# EAGLE design M220new (EAGLE 6.6.0)
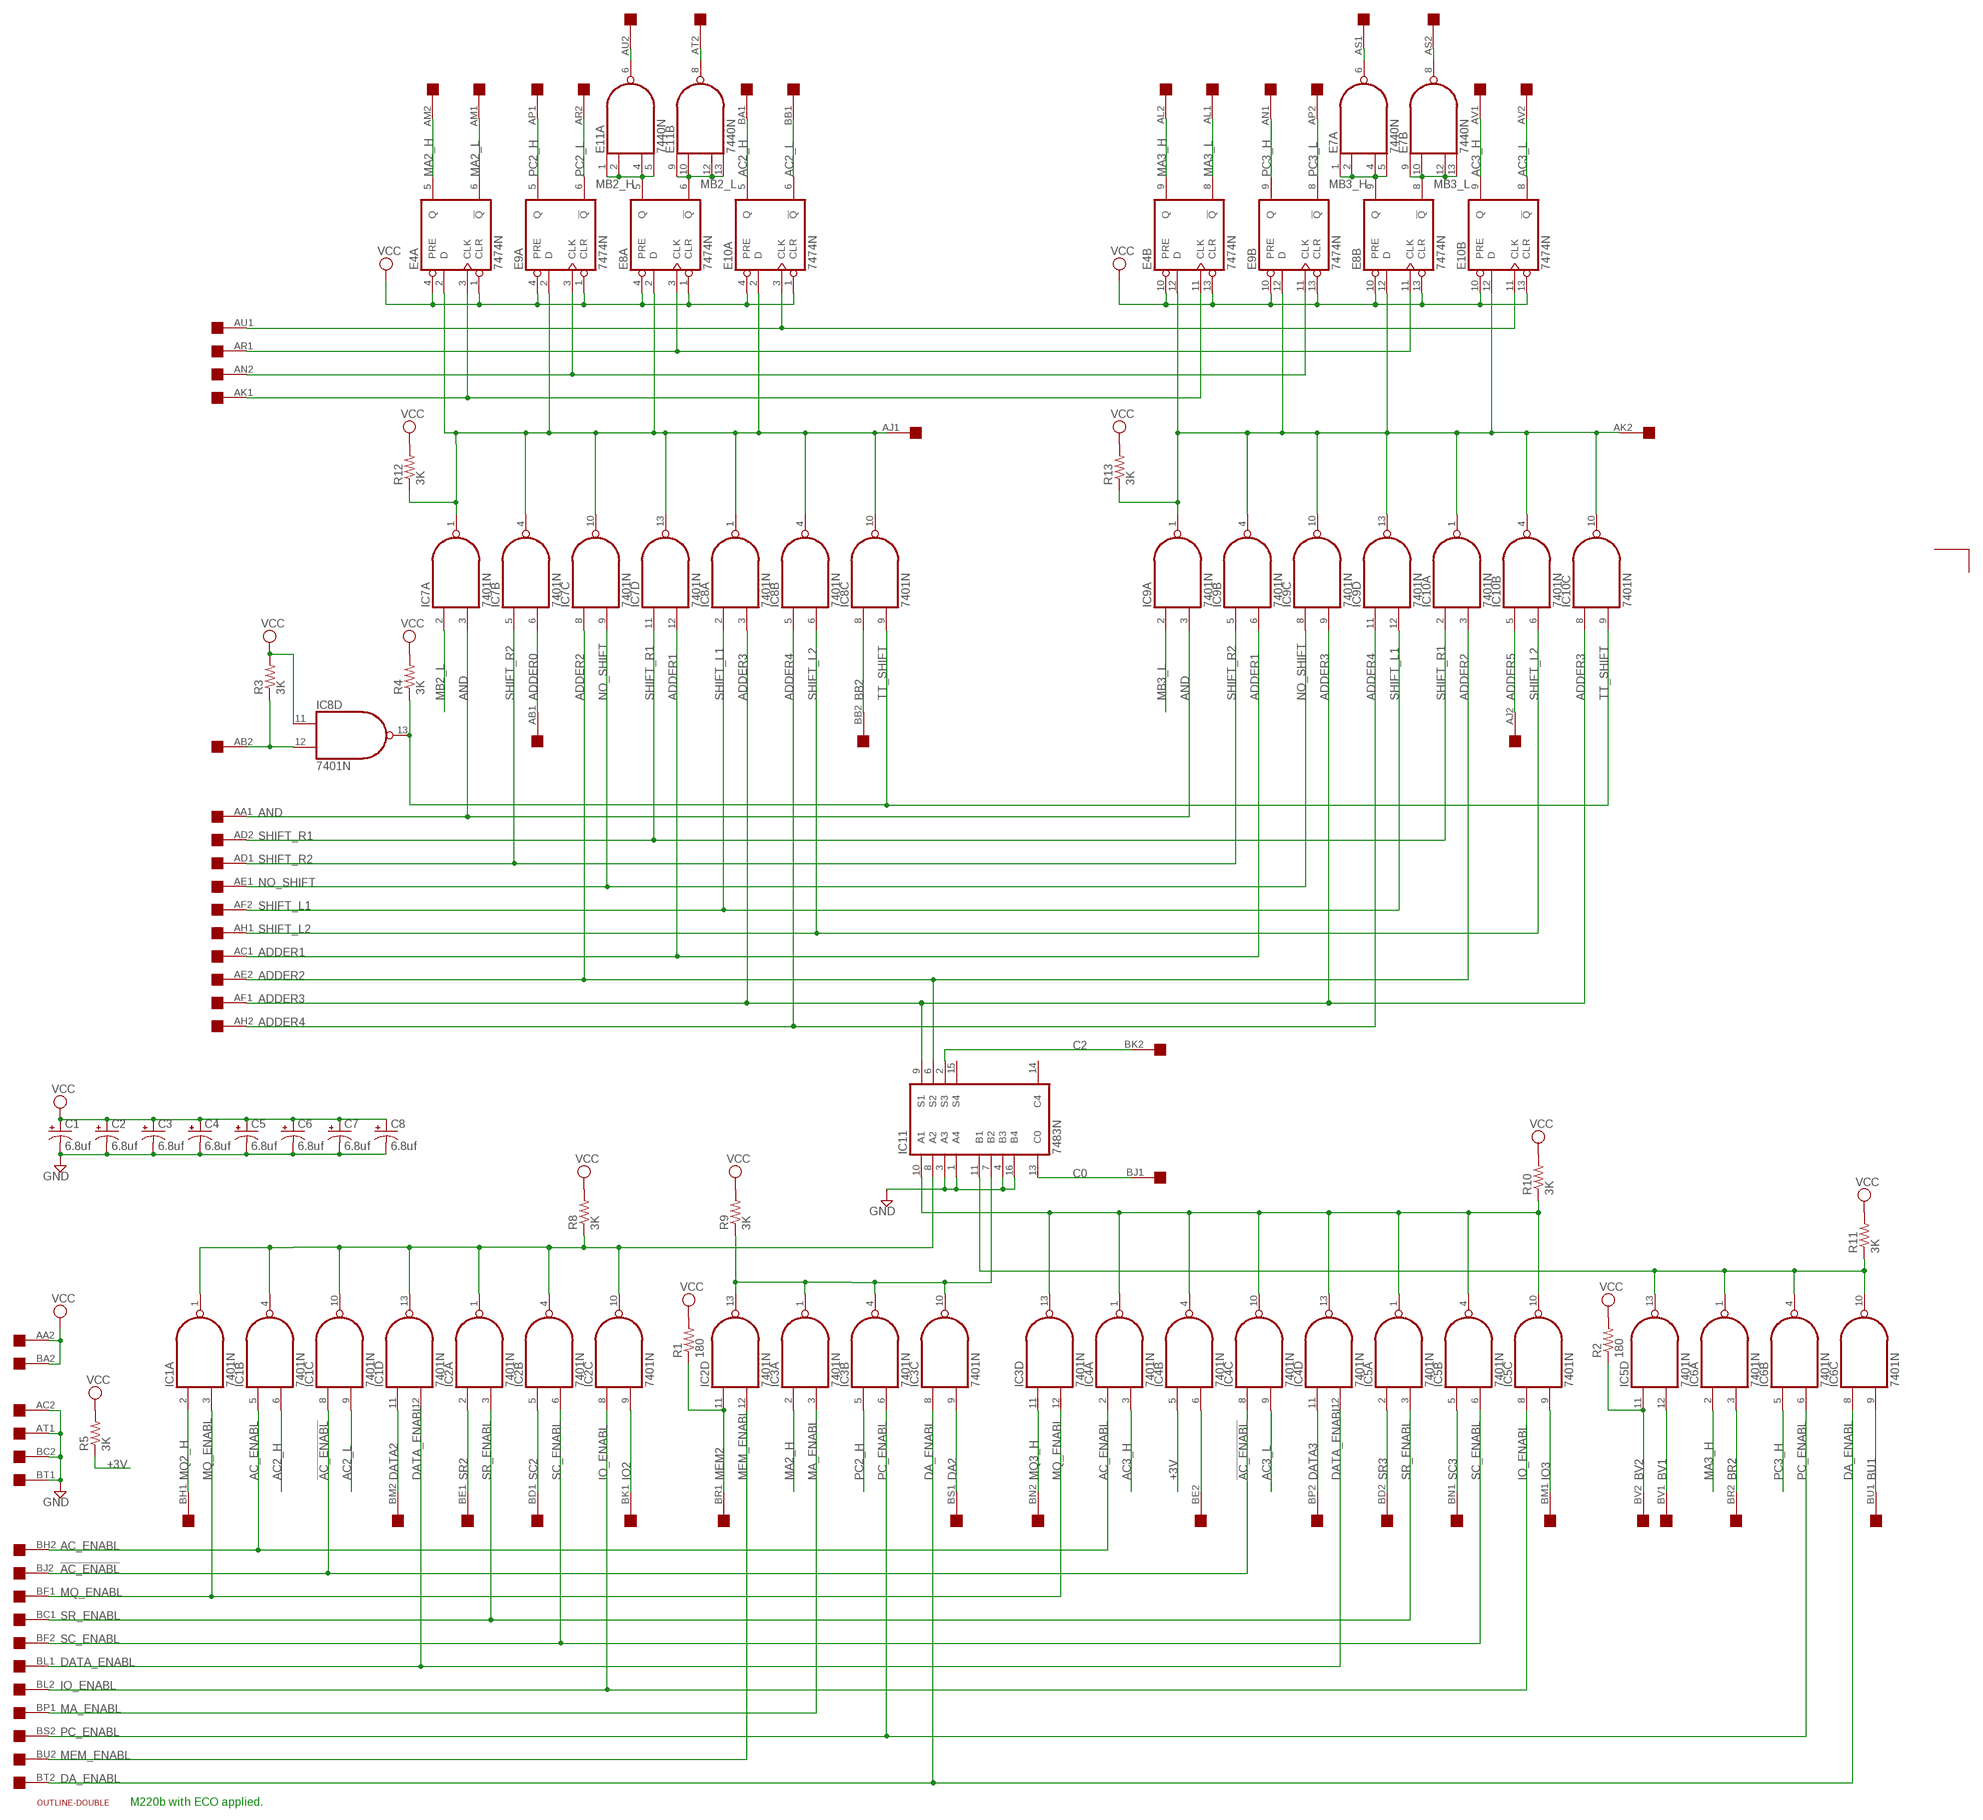
[diagram p0: schematic, sheet 1]

## Parts
C1  6.8uf  CPOL-USE15-5AXIAL  [E15-5]
C2  6.8uf  CPOL-USE15-5AXIAL  [E15-5]
C3  6.8uf  CPOL-USE15-5AXIAL  [E15-5]
C4  6.8uf  CPOL-USE15-5AXIAL  [E15-5]
C5  6.8uf  CPOL-USE15-5AXIAL  [E15-5]
C6  6.8uf  CPOL-USE15-5AXIAL  [E15-5]
C7  6.8uf  CPOL-USE15-5AXIAL  [E15-5]
C8  6.8uf  CPOL-USE15-5AXIAL  [E15-5]
E4  7474N  74S74N  [DIL14]
E7  7440N  74S20N  [DIL14]
E8  7474N  74S74N  [DIL14]
E9  7474N  74S74N  [DIL14]
E10  7474N  74S74N  [DIL14]
E11  7440N  74S20N  [DIL14]
IC1  7401N  74LS01N  [DIL14]
IC2  7401N  74LS01N  [DIL14]
IC3  7401N  74LS01N  [DIL14]
IC4  7401N  74LS01N  [DIL14]
IC5  7401N  74LS01N  [DIL14]
IC6  7401N  74LS01N  [DIL14]
IC7  7401N  74LS01N  [DIL14]
IC8  7401N  74LS01N  [DIL14]
IC9  7401N  74LS01N  [DIL14]
IC10  7401N  74LS01N  [DIL14]
IC11  7483N  [DIL16]
R1  180  R-US_0207/10  [0207/10]
R2  180  R-US_0207/10  [0207/10]
R3  3K  R-US_0207/10  [0207/10]
R4  3K  R-US_0207/10  [0207/10]
R5  3K  R-US_0207/10  [0207/10]
R8  3K  R-US_0207/10  [0207/10]
R9  3K  R-US_0207/10  [0207/10]
R10  3K  R-US_0207/10  [0207/10]
R11  3K  R-US_0207/10  [0207/10]
R12  3K  R-US_0207/10  [0207/10]
R13  3K  R-US_0207/10  [0207/10]
U$1  DOUBLE  [EDGE-CON4]
U$2  OUTLINE-DOUBLE  [DOUBLE]

## Nets
!AC_ENABL: IC1.8(C:I0) IC4.8(C:I0) U$1.BJ2
!TT_SHIFT: IC8.12(D:I1) R3.1 U$1.AB2
+3V: IC4.5(B:I0) R5.1
AC2_H: E10.5(A:Q) IC1.6(B:I1) U$1.BA1
AC2_L: E10.6(A:!Q) IC1.9(C:I1) U$1.BB1
AC3_H: E10.9(B:Q) IC4.3(A:I1) U$1.AV1
AC3_L: E10.8(B:!Q) IC4.9(C:I1) U$1.AV2
AC_ENABL: IC1.5(B:I0) IC4.2(A:I0) U$1.BH2
ADDER0: IC7.6(B:I1) U$1.AB1
ADDER1: IC7.12(D:I1) IC9.6(B:I1) U$1.AC1
ADDER2: IC7.8(C:I0) IC10.3(A:I1) IC11.6(S2) U$1.AE2
ADDER3: IC8.3(A:I1) IC9.9(C:I1) IC10.8(C:I0) IC11.9(S1) U$1.AF1
ADDER4: IC8.5(B:I0) IC9.11(D:I0) U$1.AH2
ADDER5: IC10.5(B:I0) U$1.AJ2
AJ1: E4.2(A:D) E8.2(A:D) E9.2(A:D) E10.2(A:D) IC7.1(A:O) IC7.4(B:O) IC7.10(C:O) IC7.13(D:O) IC8.1(A:O) IC8.4(B:O) IC8.10(C:O) R12.1 U$1.AJ1
AK1: E4.3(A:CLK) E4.11(B:CLK) U$1.AK1
AK2: E4.12(B:D) E8.12(B:D) E9.12(B:D) E10.12(B:D) IC9.1(A:O) IC9.4(B:O) IC9.10(C:O) IC9.13(D:O) IC10.1(A:O) IC10.4(B:O) IC10.10(C:O) R13.1 U$1.AK2
AN2: E9.3(A:CLK) E9.11(B:CLK) U$1.AN2
AND: IC7.3(A:I1) IC9.3(A:I1) U$1.AA1
AR1: E8.3(A:CLK) E8.11(B:CLK) U$1.AR1
AS1: E7.6(A:O) U$1.AS1
AS2: E7.8(B:O) U$1.AS2
AT2: E11.8(B:O) U$1.AT2
AU1: E10.3(A:CLK) E10.11(B:CLK) U$1.AU1
AU2: E11.6(A:O) U$1.AU2
BB2: IC8.8(C:I0) U$1.BB2
BE2: IC4.6(B:I1) U$1.BE2
BR2: IC6.3(A:I1) U$1.BR2
BU1: IC6.9(C:I1) U$1.BU1
BV1: IC5.12(D:I1) U$1.BV1
BV2: IC5.11(D:I0) R2.1 U$1.BV2
C0: IC11.13(C0) U$1.BJ1
C2: IC11.2(S3) U$1.BK2
DA2: IC3.9(C:I1) U$1.BS1
DA_ENABL: IC3.8(C:I0) IC6.8(C:I0) U$1.BT2
DATA2: IC1.11(D:I0) U$1.BM2
DATA3: IC4.11(D:I0) U$1.BP2
DATA_ENABL: IC1.12(D:I1) IC4.12(D:I1) U$1.BL1
GND: C1.- C2.- C3.- C4.- C5.- C6.- C7.- C8.- IC11.1(A4) IC11.3(A3) IC11.4(B3) IC11.16(B4) U$1.AC2 U$1.AT1 U$1.BC2 U$1.BT1
IO2: IC2.9(C:I1) U$1.BK1
IO3: IC5.9(C:I1) U$1.BM1
IO_ENABL: IC2.8(C:I0) IC5.8(C:I0) U$1.BL2
MA2_H: E4.5(A:Q) IC3.2(A:I0) U$1.AM2
MA2_L: E4.6(A:!Q) U$1.AM1
MA3_H: E4.9(B:Q) IC6.2(A:I0) U$1.AL2
MA3_L: E4.8(B:!Q) U$1.AL1
MA_ENABL: IC3.3(A:I1) U$1.BP1
MB2_H: E8.5(A:Q) E11.1(A:I0) E11.2(A:I1) E11.4(A:I2) E11.5(A:I3)
MB2_L: E8.6(A:!Q) E11.9(B:I0) E11.10(B:I1) E11.12(B:I2) E11.13(B:I3) IC7.2(A:I0)
MB3_H: E7.1(A:I0) E7.2(A:I1) E7.4(A:I2) E7.5(A:I3) E8.9(B:Q)
MB3_L: E7.9(B:I0) E7.10(B:I1) E7.12(B:I2) E7.13(B:I3) E8.8(B:!Q) IC9.2(A:I0)
MEM2: IC2.11(D:I0) R1.1 U$1.BR1
MEM_ENABL: IC2.12(D:I1) U$1.BU2
MQ2_H: IC1.2(A:I0) U$1.BH1
MQ3_H: IC3.11(D:I0) U$1.BN2
MQ_ENABL: IC1.3(A:I1) IC3.12(D:I1) U$1.BF1
N$5: IC1.1(A:O) IC1.4(B:O) IC1.10(C:O) IC1.13(D:O) IC2.1(A:O) IC2.4(B:O) IC2.10(C:O) IC11.8(A2) R8.1
N$8: IC3.13(D:O) IC4.1(A:O) IC4.4(B:O) IC4.10(C:O) IC4.13(D:O) IC5.1(A:O) IC5.4(B:O) IC5.10(C:O) IC11.10(A1) R10.1
N$12: IC2.13(D:O) IC3.1(A:O) IC3.4(B:O) IC3.10(C:O) IC11.7(B2) R9.1
N$14: IC5.13(D:O) IC6.1(A:O) IC6.4(B:O) IC6.10(C:O) IC11.11(B1) R11.1
NO_SHIFT: IC7.9(C:I1) IC9.8(C:I0) U$1.AE1
PC2_H: E9.5(A:Q) IC3.5(B:I0) U$1.AP1
PC2_L: E9.6(A:!Q) U$1.AR2
PC3_H: E9.9(B:Q) IC6.5(B:I0) U$1.AN1
PC3_L: E9.8(B:!Q) U$1.AP2
PC_ENABL: IC3.6(B:I1) IC6.6(B:I1) U$1.BS2
SC2: IC2.5(B:I0) U$1.BD1
SC3: IC5.5(B:I0) U$1.BN1
SC_ENABL: IC2.6(B:I1) IC5.6(B:I1) U$1.BF2
SHIFT_L1: IC8.2(A:I0) IC9.12(D:I1) U$1.AF2
SHIFT_L2: IC8.6(B:I1) IC10.6(B:I1) U$1.AH1
SHIFT_R1: IC7.11(D:I0) IC10.2(A:I0) U$1.AD2
SHIFT_R2: IC7.5(B:I0) IC9.5(B:I0) U$1.AD1
SR2: IC2.2(A:I0) U$1.BE1
SR3: IC5.2(A:I0) U$1.BD2
SR_ENABL: IC2.3(A:I1) IC5.3(A:I1) U$1.BC1
TT_SHIFT: IC8.9(C:I1) IC8.13(D:O) IC10.9(C:I1) R4.1
VCC: C1.+ C2.+ C3.+ C4.+ C5.+ C6.+ C7.+ C8.+ E4.1(A:CLR) E4.4(A:PRE) E4.10(B:PRE) E4.13(B:CLR) E8.1(A:CLR) E8.4(A:PRE) E8.10(B:PRE) E8.13(B:CLR) E9.1(A:CLR) E9.4(A:PRE) E9.10(B:PRE) E9.13(B:CLR) E10.1(A:CLR) E10.4(A:PRE) E10.10(B:PRE) E10.13(B:CLR) IC8.11(D:I0) R1.2 R2.2 R3.2 R4.2 R5.2 R8.2 R9.2 R10.2 R11.2 R12.2 R13.2 U$1.AA2 U$1.BA2
Unconnected: IC6.11(D:I0) IC6.12(D:I1) IC6.13(D:O) IC10.11(D:I0) IC10.12(D:I1) IC10.13(D:O) IC11.14(C4) IC11.15(S4)

## Notes on the sheet
- M220b with ECO applied.

## Power pins joined to a net without a drawn wire
GND: E4.7(P:GND) E7.7(P:GND) E8.7(P:GND) E9.7(P:GND) E10.7(P:GND) E11.7(P:GND) IC1.7(P:GND) IC2.7(P:GND) IC3.7(P:GND) IC4.7(P:GND) IC5.7(P:GND) IC6.7(P:GND) IC7.7(P:GND) IC8.7(P:GND) IC9.7(P:GND) IC10.7(P:GND) IC11.12(GND)
VCC: E4.14(P:VCC) E7.14(P:VCC) E8.14(P:VCC) E9.14(P:VCC) E10.14(P:VCC) E11.14(P:VCC) IC1.14(P:VCC) IC2.14(P:VCC) IC3.14(P:VCC) IC4.14(P:VCC) IC5.14(P:VCC) IC6.14(P:VCC) IC7.14(P:VCC) IC8.14(P:VCC) IC9.14(P:VCC) IC10.14(P:VCC) IC11.5(VCC)

## Library data of the parts
C1-C8 = rcl:CPOL-US: POLARIZED CAPACITOR, American symbol
E4 E8-E10 = 74xx-us:74*74: Dual D type positive edge triggered FLIP FLOP, preset and clear
E7 E11 = 74xx-us:74*20: Dual 4-input NAND gate
IC1-IC10 = 74xx-us:74*01: Quad 2-input NAND gate, open collector
IC11 = 74xx-us:74*83: 4-bit binary full ADDER, fast carry
R1-R5 R8-R13 = rcl:R-US_: RESISTOR, American symbol
U$1 = dec-con:DOUBLE: Double-Height DEC board
U$2 = dec-con:OUTLINE-*: Board outlines for DEC boards.

## Board
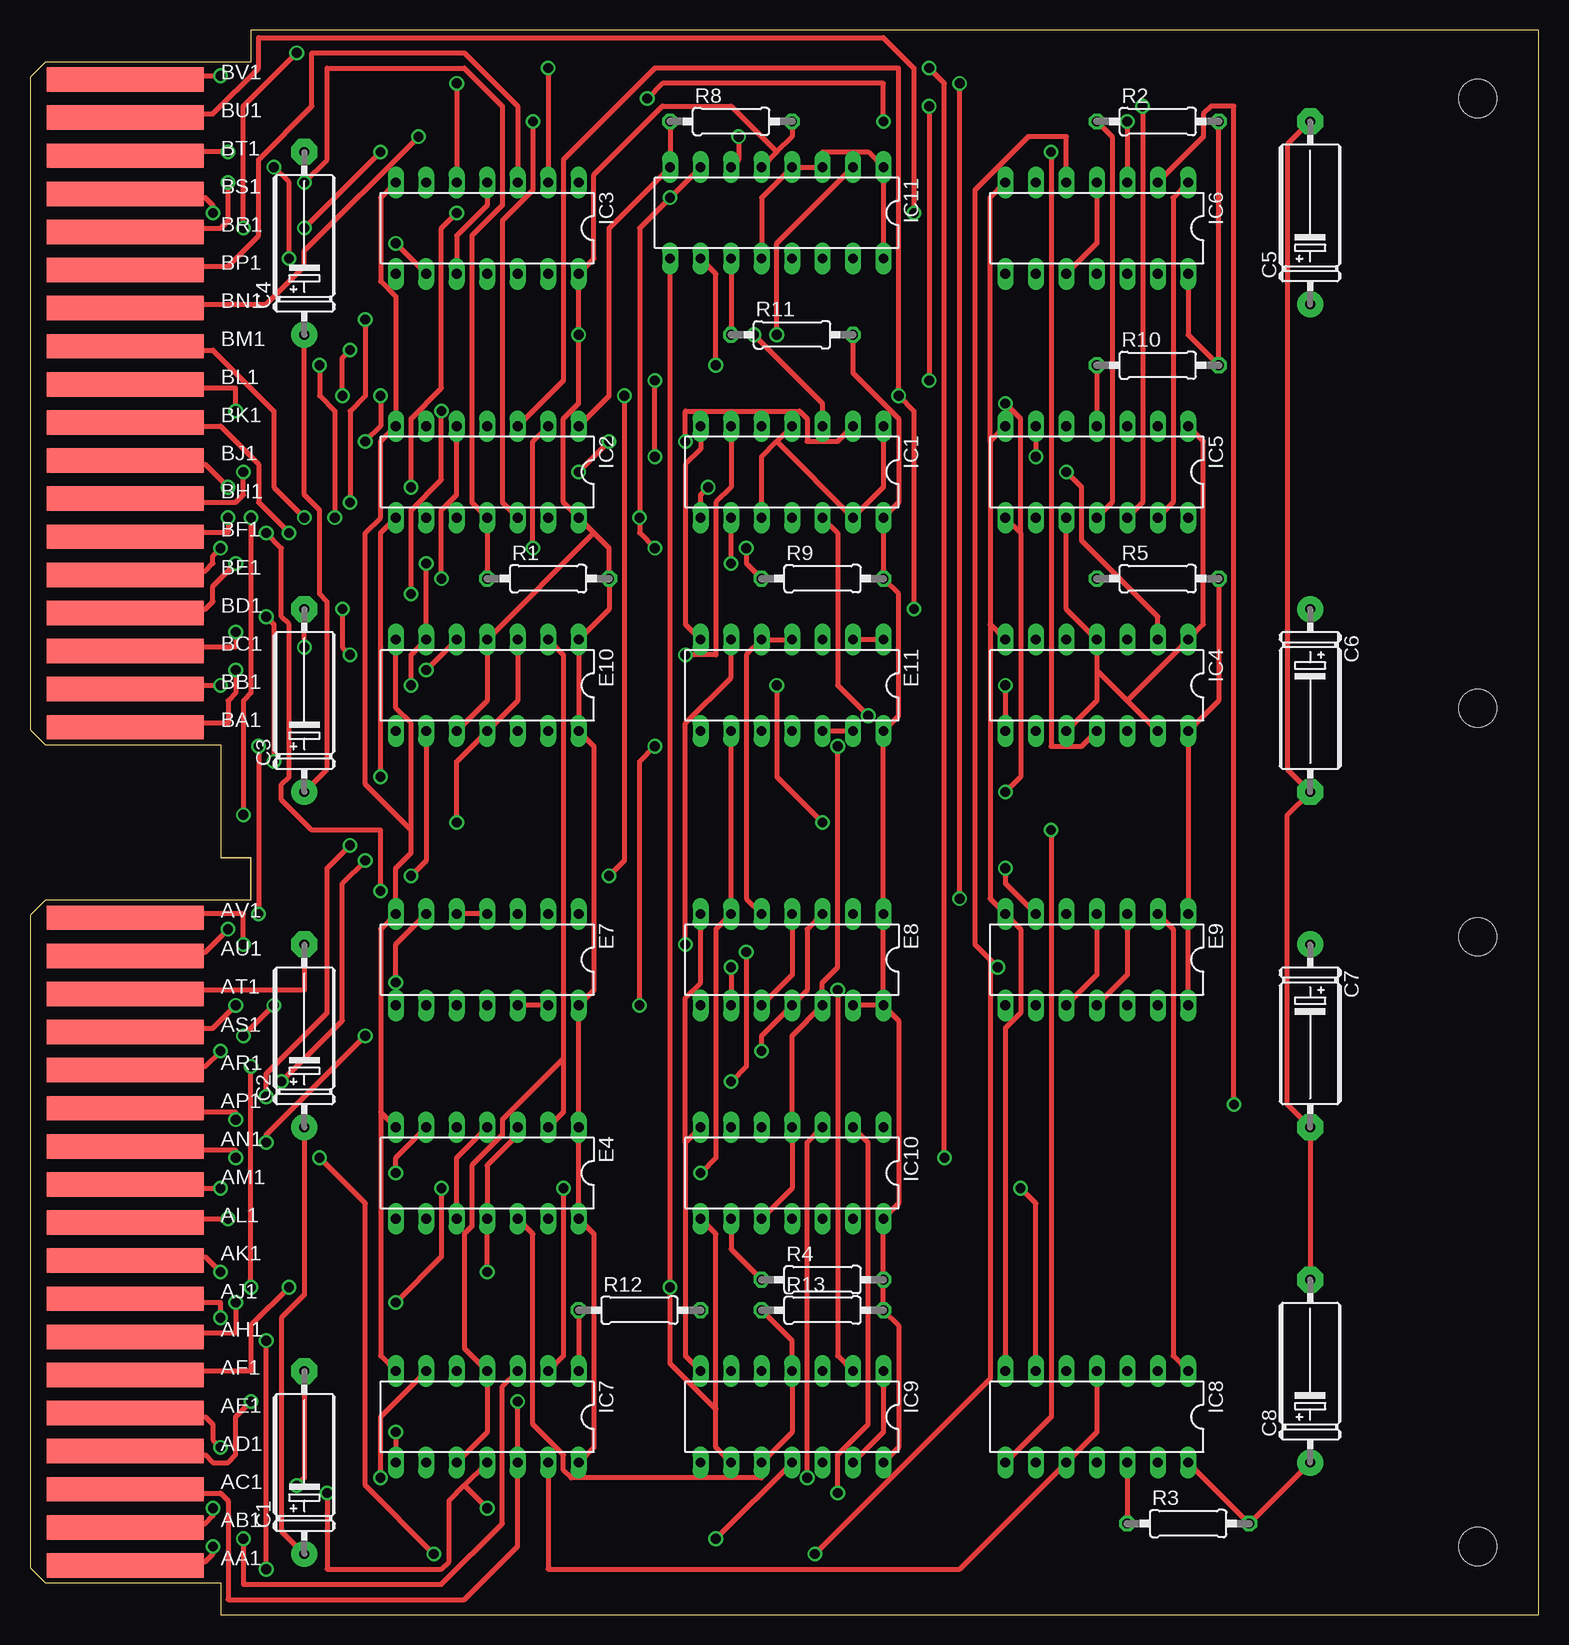
[diagram p1: board, top side]
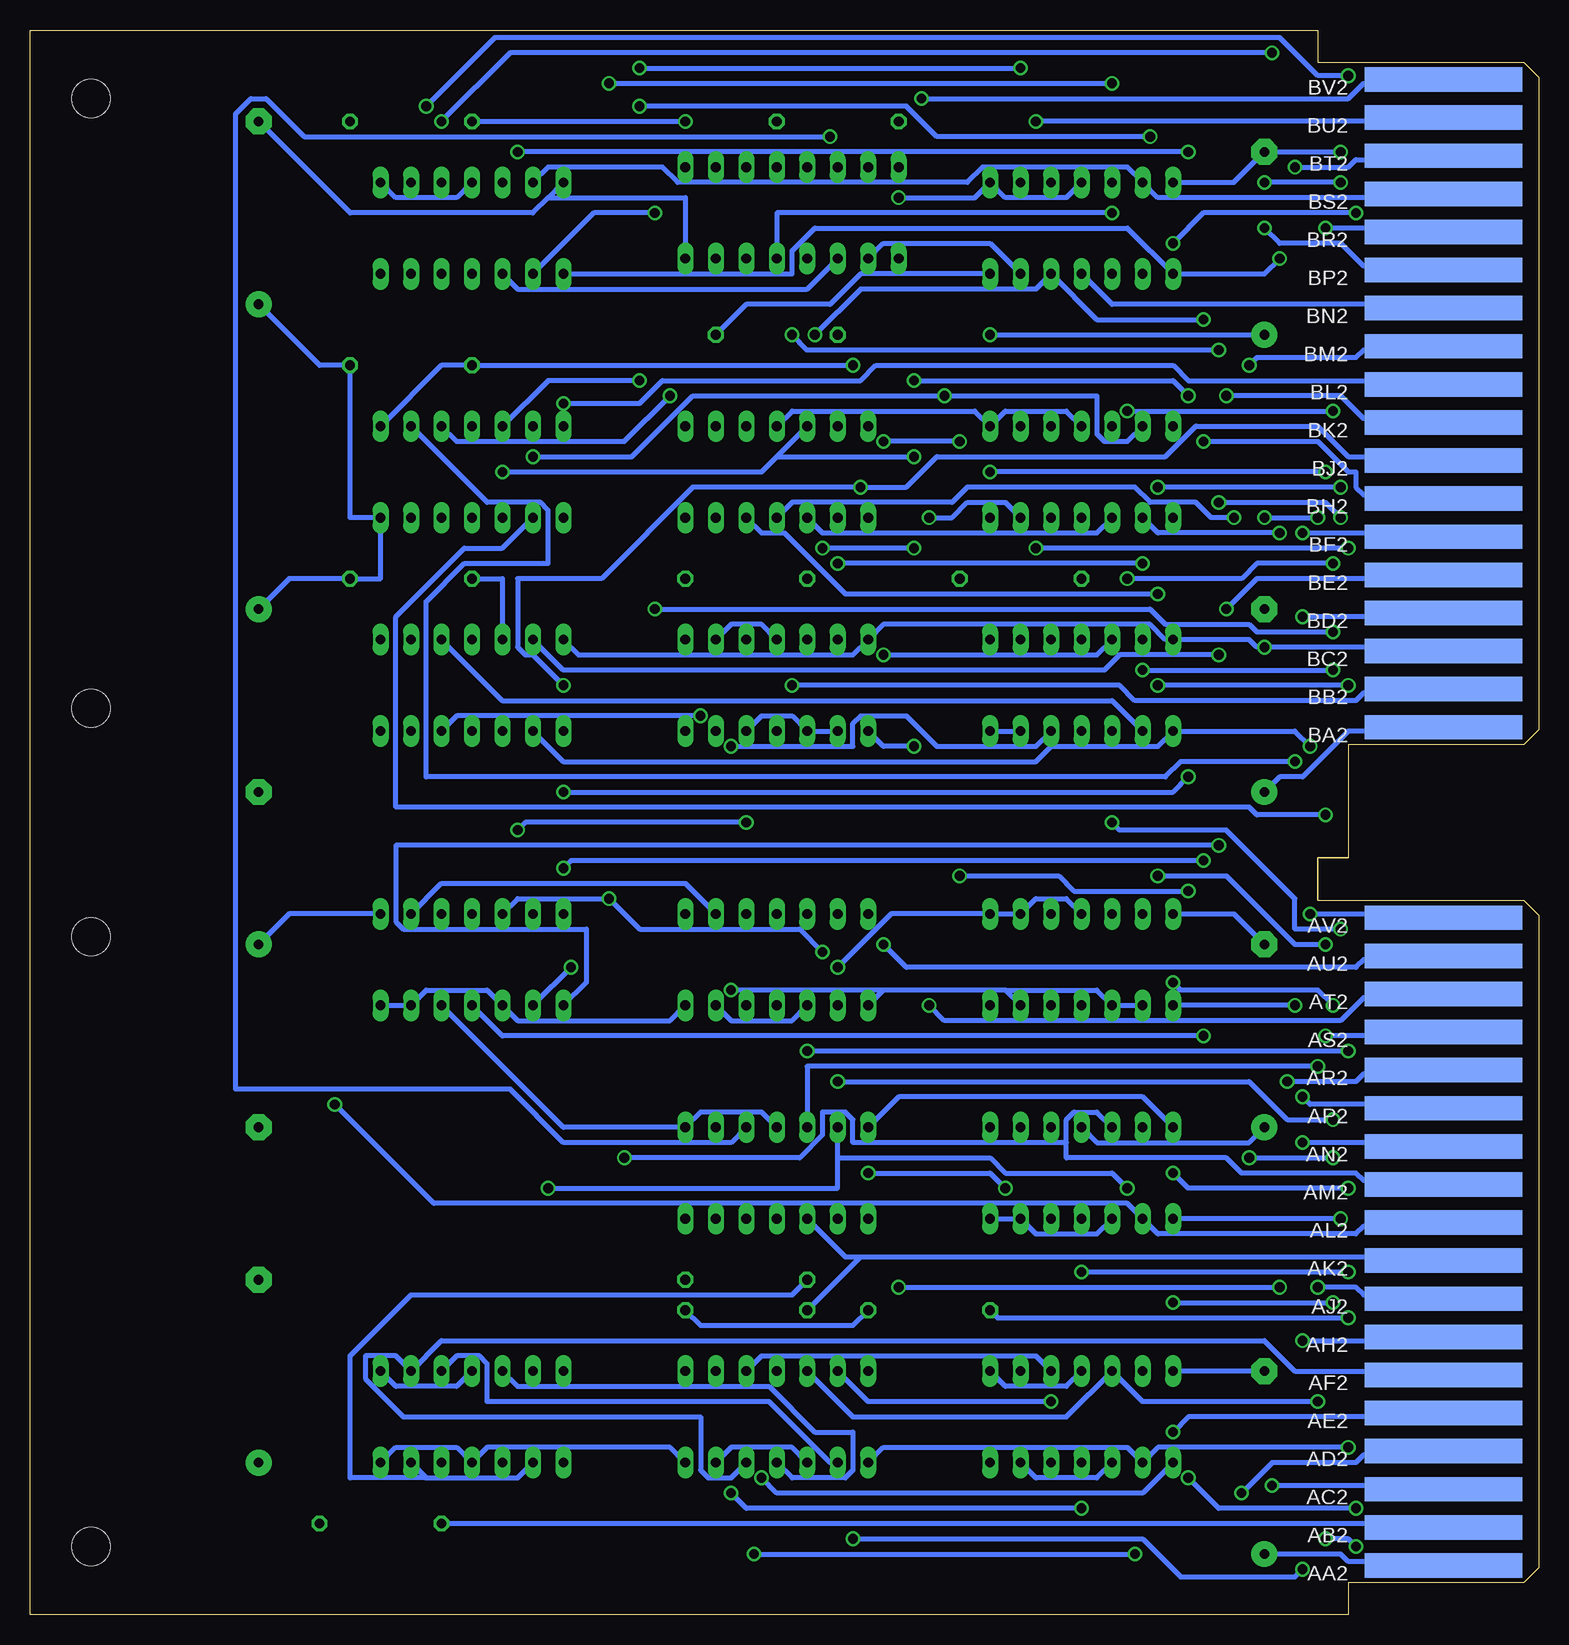
[diagram p2: board, bottom side, seen from below]

Size 125.73 x 132.08 mm. Coordinates in mm from the lower left corner, seen from the top.
Copper layers (1+16): Top 0.035mm / dielectric 1.5mm / Bottom 0.035mm
Design rules "16mils": minimum track width 16mil, minimum drill 32mil, track to track 15mil, track to pad 10mil, pad to pad 10mil, via to via 10mil, smd to smd 10mil, copper to edge 13mil, drill to drill 10mil, minimum pad ring 10mil, minimum via ring 8mil, stop-mask expansion 0mil, vias tented up to drill 0mil, thermal gap 10mil

### Footprints (pad centres in the part's own frame; a part is rotated, then mirrored left to right if it is on the bottom)
E15-5 = drill 0.813 pad 2.159: + -7.62,0 | drill 0.813 pad 2.159 octagon: - 7.62,0
DIL14 = drill 0.813 long: 1 -7.62,-3.81; 2 -5.08,-3.81; 3 -2.54,-3.81; 4 0,-3.81; 5 2.54,-3.81; 6 5.08,-3.81; 7 7.62,-3.81; 8 7.62,3.81; 9 5.08,3.81; 10 2.54,3.81; 11 0,3.81; 12 -2.54,3.81; 13 -5.08,3.81; 14 -7.62,3.81
DIL16 = drill 0.813 long: 1 -8.89,-3.81; 2 -6.35,-3.81; 3 -3.81,-3.81; 4 -1.27,-3.81; 5 1.27,-3.81; 6 3.81,-3.81; 7 6.35,-3.81; 8 8.89,-3.81; 9 8.89,3.81; 10 6.35,3.81; 11 3.81,3.81; 12 1.27,3.81; 13 -1.27,3.81; 14 -3.81,3.81; 15 -6.35,3.81; 16 -8.89,3.81
0207/10 = drill 0.813 octagon: 1 -5.08,0; 2 5.08,0
EDGE-CON4 = smd 13.106 x 2.032: AA1 7.938,4.128; AB1 7.938,7.303; AC1 7.938,10.477; AD1 7.938,13.652; AE1 7.938,16.828; AF1 7.938,20.003; AH1 7.938,23.177; AJ1 7.938,26.352; AK1 7.938,29.527; AL1 7.938,32.703; AM1 7.938,35.877; AN1 7.938,39.053; AP1 7.938,42.227; AR1 7.938,45.403; AS1 7.938,48.578; AT1 7.938,51.752; AU1 7.938,54.928; AV1 7.938,58.102; BA1 7.938,73.978; BB1 7.938,77.153; BC1 7.938,80.328; BD1 7.938,83.502; BE1 7.938,86.677; BF1 7.938,89.853; BH1 7.938,93.028; BJ1 7.938,96.203; BK1 7.938,99.377; BL1 7.938,102.552; BM1 7.938,105.728; BN1 7.938,108.903; BP1 7.938,112.078; BR1 7.938,115.252; BS1 7.938,118.427; BT1 7.938,121.603; BU1 7.938,124.778; BV1 7.938,127.953 | smd 13.106 x 2.032 bottom: AA2 7.938,4.128; AB2 7.938,7.303; AC2 7.938,10.477; AD2 7.938,13.652; AE2 7.938,16.828; AF2 7.938,20.003; AH2 7.938,23.177; AJ2 7.938,26.352; AK2 7.938,29.527; AL2 7.938,32.703; AM2 7.938,35.877; AN2 7.938,39.053; AP2 7.938,42.227; AR2 7.938,45.403; AS2 7.938,48.578; AT2 7.938,51.752; AU2 7.938,54.928; AV2 7.938,58.102; BA2 7.938,73.978; BB2 7.938,77.153; BC2 7.938,80.328; BD2 7.938,83.502; BE2 7.938,86.677; BF2 7.938,89.853; BH2 7.938,93.028; BJ2 7.938,96.203; BK2 7.938,99.377; BL2 7.938,102.552; BM2 7.938,105.728; BN2 7.938,108.903; BP2 7.938,112.078; BR2 7.938,115.252; BS2 7.938,118.427; BT2 7.938,121.603; BU2 7.938,124.778; BV2 7.938,127.953
DOUBLE = hole 3.175: 120.65,56.515; 120.65,5.715; 120.65,75.565; 120.65,126.365

### Placement (x,y rotation side)
C1  22.86,12.7 90 top
C2  22.86,48.26 90 top
C3  22.86,76.2 90 top
C4  22.86,114.3 90 top
C5  106.68,116.84 90 top
C6  106.68,76.2 270 top
C7  106.68,48.26 270 top
C8  106.68,20.32 90 top
E4  38.1,36.83 180 top
E7  38.1,54.61 180 top
E8  63.5,54.61 180 top
E9  88.9,54.61 180 top
E10  38.1,77.47 180 top
E11  63.5,77.47 180 top
IC1  63.5,95.25 180 top
IC2  38.1,95.25 180 top
IC3  38.1,115.57 180 top
IC4  88.9,77.47 180 top
IC5  88.9,95.25 180 top
IC6  88.9,115.57 180 top
IC7  38.1,16.51 180 top
IC8  88.9,16.51 180 top
IC9  63.5,16.51 180 top
IC10  63.5,36.83 180 top
IC11  62.23,116.84 180 top
R1  43.18,86.36 0 top
R2  93.98,124.46 0 top
R3  96.52,7.62 0 top
R4  66.04,27.94 0 top
R5  93.98,86.36 0 top
R8  58.42,124.46 0 top
R9  66.04,86.36 0 top
R10  93.98,104.14 0 top
R11  63.5,106.68 0 top
R12  50.8,25.4 0 top
R13  66.04,25.4 0 top
U$1  0,0 0 top
U$2  0,0 0 top

### Tracks (layer width: path | path; a pad name or v marks a point on that pad's centre or on a via)
!AC_ENABL  (via drill 0.81)
  Top 0.406: v81.28,77.47 IC4.8 | v56.52,93.98 55.88,93.34 IC1.8
  Bottom 0.406: v81.28,77.47 83.82,80.01 84.46,80.01 85.09,80.64 85.09,86.36 78.11,86.36 70.49,93.98 v56.52,93.98 52.71,93.98 50.17,96.52 31.12,96.52 28.58,99.06 18.42,99.06 15.88,96.52 8.26,96.52 U$1.BJ2
!TT_SHIFT
  Top 0.406: IC8.12 R3.1
  Bottom 0.406: R3.1 8.26,7.62 U$1.AB2
+3V
  Bottom 0.406: IC4.5 86.36,86.36 R5.1
AC2_H  (via drill 0.81)
  Top 0.406: v54.61,80.01 57.15,80.01 57.15,92.71 58.42,93.98 IC1.6 | v17.15,78.74 17.15,76.83 16.51,76.2 16.51,74.3 8.26,74.3 U$1.BA1 | E10.5 v33.02,78.74
  Bottom 0.406: E10.5 36.83,80.01 v54.61,80.01 | v33.02,78.74 v17.15,78.74
AC2_L  (via drill 0.81)
  Top 0.406: v31.75,77.47 31.75,80.01 E10.6 v33.02,87.63 | v15.88,77.47 8.26,77.47 U$1.BB1 | v58.42,87.63 IC1.9
  Bottom 0.406: v15.88,77.47 v31.75,77.47 | v33.02,87.63 v58.42,87.63
AC3_H  (via drill 0.81)
  Top 0.406: v17.78,55.88 17.78,58.42 8.26,58.42 U$1.AV1 | v31.75,61.59 33.02,62.87 E10.9
  Bottom 0.406: E10.9 35.56,76.2 86.36,76.2 IC4.3 | v17.78,55.88 20.32,55.88 26.04,61.59 v31.75,61.59
AC3_L  (via drill 0.81)
  Top 0.406: v19.05,72.39 v19.05,58.42
  Bottom 0.406: IC4.9 81.28,71.12 41.91,71.12 40.64,72.39 31.75,72.39 E10.8 20.32,73.66 v19.05,72.39 | v19.05,58.42 8.26,58.42 U$1.AV2
AC_ENABL  (via drill 0.81)
  Top 0.406: v86.36,95.25 87.63,93.98 87.63,89.53 93.98,83.19 IC4.2 | v27.94,97.79 29.21,99.06 v29.21,101.6 | v52.07,96.52 v52.07,102.87
  Bottom 0.406: 63.5,96.52 64.77,95.25 v86.36,95.25 | 63.5,96.52 IC1.5 | v27.94,97.79 18.42,97.79 15.88,95.25 15.24,95.25 15.24,93.98 14.61,93.34 8.26,93.34 U$1.BH2 | v29.21,101.6 30.48,102.87 v52.07,102.87 | 63.5,96.52 v52.07,96.52
ADDER0  (via drill 0.81)
  Top 0.406: IC7.6 29.21,16.51 v29.21,11.43 | v15.24,8.89 15.24,8.26 14.61,7.62 8.26,7.62 U$1.AB1
  Bottom 0.406: v29.21,11.43 26.67,8.89 v15.24,8.89
ADDER1  (via drill 0.81)
  Top 0.406: U$1.AC1 8.26,10.16 15.88,10.16 16.51,9.53 16.51,1.27 36.2,1.27 40.64,5.71 IC7.12 v40.64,17.78
  Bottom 0.406: IC9.6 55.88,17.78 v40.64,17.78
ADDER2  (via drill 0.81)
  Top 0.406: v30.48,15.24 IC7.8 | IC10.3 64.77,39.37 v64.77,11.43 | IC11.6 59.06,121.28 v59.06,123.19
  Bottom 0.406: v30.48,15.24 29.21,16.51 8.26,16.51 U$1.AE2 | v64.77,11.43 63.5,10.16 33.02,10.16 IC7.8 | v59.06,123.19 102.87,123.19 106.05,126.36 107.32,126.36 108.59,125.09 108.59,43.81 85.73,43.81 81.28,39.37 67.31,39.37 IC10.3
ADDER3  (via drill 0.81)
  Top 0.406: IC10.8 57.15,31.75 57.15,17.14 | 57.15,17.14 57.15,13.97 IC9.9 | IC11.9 v53.34,27.3 53.34,20.95 57.15,17.14 | v21.59,27.3 18.42,24.13 18.42,20.32 8.26,20.32 U$1.AF1
  Bottom 0.406: IC8.3 90.17,21.59 88.27,21.59 87.63,20.95 87.63,17.78 64.14,17.78 59.06,12.7 IC9.9 | v53.34,27.3 v21.59,27.3
ADDER4  (via drill 0.81)
  Top 0.406: v19.69,3.81 v19.69,22.86 | IC9.11 v57.15,6.35
  Bottom 0.406: IC9.11 62.23,11.43 57.79,11.43 57.15,12.06 57.15,15.24 60.33,15.24 64.14,19.05 85.09,19.05 IC8.5 | v19.69,22.86 8.26,22.86 U$1.AH2 | v19.69,3.81 20.32,3.17 29.85,3.17 33.02,6.35 v57.15,6.35
ADDER5  (via drill 0.81)
  Top 0.406: v18.42,27.3 v18.42,45.72
  Bottom 0.406: IC10.5 60.96,45.72 v18.42,45.72 | v18.42,27.3 15.24,27.3 14.61,26.67 8.26,26.67 U$1.AJ2
AJ1  (via drill 0.81)
  Top 0.406: IC8.4 88.9,15.24 IC8.10 77.47,3.81 43.18,3.81 IC7.13 | IC8.1 95.25,21.59 95.25,57.15 E9.2 | R12.1 IC7.1 | IC7.10 38.1,15.24 IC7.4 36.2,22.23 36.2,31.75 36.83,32.38 36.83,37.47 39.37,40.01 39.37,41.27 44.45,46.35 | E4.2 44.45,41.91 44.45,46.35 | 44.45,46.35 44.45,80.01 E10.2 | v15.88,24.77 15.88,26.04 8.26,26.04 U$1.AJ1
  Bottom 0.406: IC8.1 95.25,19.05 90.17,19.05 IC8.4 | E8.2 71.12,60.96 91.44,60.96 E9.2 | IC7.13 41.91,11.43 36.83,11.43 IC7.10 | IC7.1 44.45,19.05 39.37,19.05 IC7.4 | v15.88,24.77 45.09,24.77 R12.1
AK1  (via drill 0.81)
  Top 0.406: E4.3 40.64,40.01 38.1,37.47 E4.11 v38.1,28.57 | v15.88,28.57 14.61,29.84 8.26,29.84 U$1.AK1
  Bottom 0.406: v15.88,28.57 v38.1,28.57
AK2  (via drill 0.81)
  Top 0.406: IC9.13 71.12,15.24 IC9.1 | R13.1 63.5,22.86 IC9.4 63.5,15.24 IC9.10 60.96,11.43 45.09,11.43 44.45,12.06 44.45,13.34 41.91,15.88 41.91,31.75 E4.12 | IC10.10 63.5,35.56 IC10.4 63.5,48.26 E8.12 66.04,52.7 67.31,53.98 v67.31,72.39
  Bottom 0.406: IC9.13 67.31,13.97 62.23,13.97 IC9.10 | IC10.4 64.77,41.91 69.85,41.91 IC10.1 81.28,40.64 E9.12 | E10.12 41.91,72.39 50.17,72.39 52.71,74.93 56.52,74.93 57.15,74.3 57.15,72.39 v67.31,72.39 | 56.52,29.84 57.79,29.84 IC10.10 | 56.52,29.84 8.26,29.84 U$1.AK2 | 56.52,29.84 R13.1
AN2  (via drill 0.81)
  Top 0.406: E9.11 91.44,53.34 E9.3 | v27.94,48.26 19.69,40.01 v19.69,39.37
  Bottom 0.406: E9.11 86.36,48.26 v27.94,48.26 | v19.69,39.37 8.26,39.37 U$1.AN2
AND  (via drill 0.81)
  Top 0.406: IC7.3 39.37,19.05 39.37,7.62 34.29,2.54 17.78,2.54 v17.78,6.35 | v15.24,5.71 15.24,5.08 14.61,4.45 8.26,4.45 U$1.AA1
  Bottom 0.406: IC7.3 41.91,21.59 64.77,21.59 IC9.3 | v17.78,6.35 15.88,6.35 v15.24,5.71
AR1  (via drill 0.81)
  Top 0.406: E8.3 64.77,57.15 64.77,52.07 E8.11 60.96,48.26 v60.96,46.99 | v15.88,46.99 14.61,45.72 8.26,45.72 U$1.AR1
  Bottom 0.406: v15.88,46.99 v60.96,46.99
AS1  (via drill 0.81)
  Top 0.406: E7.6 30.48,55.88 v30.48,52.7 | v17.15,50.8 15.24,48.9 8.26,48.9 U$1.AS1
  Bottom 0.406: v30.48,52.7 29.85,52.07 18.42,52.07 v17.15,50.8
AS2  (via drill 0.81)
  Top 0.406: v17.78,48.26 v20.32,50.8
  Bottom 0.406: v20.32,50.8 E7.8 | v17.78,48.26 8.26,48.26 U$1.AS2
AT2  (via drill 0.81)
  Top 0.406: v52.07,72.39 50.8,71.12 v50.8,50.8
  Bottom 0.406: E11.8 54.61,72.39 v52.07,72.39 | v50.8,50.8 49.53,49.53 16.51,49.53 14.61,51.44 8.26,51.44 U$1.AT2
AU1  (via drill 0.81)
  Top 0.406: E10.3 40.64,76.2 E10.11 35.56,71.12 v35.56,66.04 | v16.51,57.15 14.61,55.24 8.26,55.24 U$1.AU1
  Bottom 0.406: v35.56,66.04 34.93,65.41 26.04,65.41 20.32,59.69 20.32,57.15 v16.51,57.15
AU2  (via drill 0.81)
  Top 0.406: E11.6 58.42,78.11 54.61,74.3 v54.61,55.88
  Bottom 0.406: v54.61,55.88 52.71,53.98 15.24,53.98 14.61,54.61 8.26,54.61 U$1.AU2
BB2  (via drill 0.81)
  Top 0.406: IC8.8 85.09,16.51 v85.09,65.41 | v66.04,66.04 62.23,69.85 v62.23,77.47
  Bottom 0.406: v85.09,65.41 84.46,66.04 v66.04,66.04 | v62.23,77.47 34.93,77.47 33.66,76.2 15.24,76.2 14.61,76.83 8.26,76.83 U$1.BB2
BE2  (via drill 0.81)
  Top 0.406: v26.67,80.01 26.04,80.64 v26.04,83.82
  Bottom 0.406: IC4.6 81.28,78.74 36.2,78.74 34.93,80.01 v26.67,80.01 | v26.04,83.82 23.5,86.36 8.26,86.36 U$1.BE2
BR2  (via drill 0.81)
  Top 0.406: v91.44,124.46 IC6.3 | v22.23,130.18 17.78,125.73 v17.78,115.57
  Bottom 0.406: v91.44,124.46 85.73,130.18 v22.23,130.18 | v17.78,115.57 8.26,115.57 U$1.BR2
BU1  (via drill 0.81)
  Top 0.406: v73.66,116.84 73.66,128.91 71.12,131.44 19.05,131.44 19.05,128.91 15.24,125.09 8.26,125.09 U$1.BU1
  Bottom 0.406: IC6.9 78.74,116.84 v73.66,116.84
BV1  (via drill 0.81)
  Top 0.406: IC5.12 92.71,92.71 v92.71,125.73 | v15.88,128.27 8.26,128.27 U$1.BV1
  Bottom 0.406: v92.71,125.73 87,131.44 21.59,131.44 18.42,128.27 v15.88,128.27
BV2  (via drill 0.81)
  Top 0.406: IC5.11 90.17,92.71 90.17,123.19 R2.1 | v51.44,126.36 52.71,127.64 71.12,127.64 v71.12,124.46
  Bottom 0.406: v51.44,126.36 15.88,126.36 14.61,127.64 8.26,127.64 U$1.BV2 | R2.1 v71.12,124.46
C0  (via drill 0.81)
  Top 0.406: v35.56,116.84 34.29,115.57 34.29,102.23 31.75,99.69 v31.75,93.98 | v16.51,93.98 14.61,95.89 8.26,95.89 U$1.BJ1
  Bottom 0.406: IC11.13 63.5,116.84 v35.56,116.84 | v16.51,93.98 v31.75,93.98
C2  (via drill 0.81)
  Top 0.406: IC11.2 62.23,114.3 v62.23,106.68 | v26.67,105.41 26.04,104.78 v26.04,101.6
  Bottom 0.406: v62.23,106.68 60.96,105.41 v26.67,105.41 | v26.04,101.6 16.51,101.6 14.61,99.69 8.26,99.69 U$1.BK2
DA2  (via drill 0.81)
  Top 0.406: v30.48,114.3 IC3.9 | v15.24,116.84 15.24,117.47 14.61,118.11 8.26,118.11 U$1.BS1
  Bottom 0.406: v30.48,114.3 27.94,116.84 v15.24,116.84
DA_ENABL  (via drill 0.81)
  Top 0.406: v20.32,120.65 21.59,119.38 v21.59,113.03
  Bottom 0.406: IC6.8 62.23,111.76 62.23,113.67 60.33,115.57 34.29,115.57 IC3.8 22.86,111.76 v21.59,113.03 | v20.32,120.65 15.88,120.65 15.24,121.28 8.26,121.28 U$1.BT2
DATA2  (via drill 0.81)
  Top 0.406: v25.4,91.44 25.4,100.33 24.13,101.6 v24.13,104.14
  Bottom 0.406: IC1.11 62.23,92.71 48.9,92.71 47.63,93.98 33.66,93.98 32.39,92.71 28.58,92.71 27.31,91.44 v25.4,91.44 | v24.13,104.14 23.5,104.78 15.24,104.78 14.61,105.41 8.26,105.41 U$1.BM2
DATA3  (via drill 0.81)
  Top 0.406: IC4.11 87.63,72.39 85.09,72.39 v85.09,121.92 | v22.86,115.57 v29.21,121.92
  Bottom 0.406: v29.21,121.92 v85.09,121.92 | v22.86,115.57 21.59,114.3 16.51,114.3 14.61,112.39 8.26,112.39 U$1.BP2
DATA_ENABL  (via drill 0.81)
  Top 0.406: v69.85,74.93 67.31,77.47 67.31,90.17 IC1.12 | v17.15,100.33 17.15,102.23 8.26,102.23 U$1.BL1 | v34.29,100.33 34.29,94.61 31.75,92.08 v31.75,85.09
  Bottom 0.406: IC4.12 90.17,74.93 v69.85,74.93 | v34.29,100.33 v17.15,100.33 | v31.75,85.09 57.79,85.09 62.87,90.17 64.77,90.17 IC1.12
GND  (via drill 0.81)
  Top 0.406: C8.- C7.- 104.78,42.55 104.78,66.67 C6.- 104.78,70.48 104.78,122.56 C5.- | IC8.7 81.28,48.9 82.55,50.16 82.55,57.15 E9.7 80.01,59.69 80.01,82.55 | IC11.16 IC11.1 69.85,121.92 66.04,121.92 IC11.3 IC11.4 60.96,118.11 IC11.12 | E11.7 54.61,82.55 54.61,95.89 55.88,97.16 IC1.7 | 80.01,82.55 IC4.7 | 80.01,97.79 80.01,82.55 | IC5.7 80.01,97.79 | IC6.7 80.01,118.11 80.01,97.79 | IC3.7 29.21,118.11 29.21,111.12 30.48,109.86 IC2.7 29.21,97.79 29.21,91.44 27.94,90.17 27.94,69.22 31.75,65.41 | v16.51,121.92 8.26,121.92 U$1.BT1 | v22.86,80.64 C3.- | IC9.7 54.61,21.59 54.61,39.37 | IC10.7 54.61,39.37 | E8.7 55.88,52.7 54.61,51.44 54.61,39.37 | 29.21,41.91 E4.7 | 29.21,41.91 29.21,57.15 E7.7 30.48,62.23 31.75,63.5 31.75,65.41 | IC7.7 29.21,21.59 29.21,41.91 | v22.23,10.79 22.86,11.43 C1.- | C2.- 22.86,52.07 8.26,52.07 U$1.AT1 | E10.7 30.48,75.56 31.75,74.3 31.75,65.41
  Bottom 0.406: C5.- 99.06,116.84 83.82,116.84 82.55,118.11 | IC6.7 82.55,118.11 | IC4.7 80.01,80.01 57.15,80.01 E11.7 54.61,82.55 32.39,82.55 31.12,81.28 E10.7 24.13,81.28 23.5,80.64 v22.86,80.64 8.26,80.64 U$1.BC2 | IC11.16 71.12,118.11 82.55,118.11 | IC3.7 25.4,119.38 C4.- v16.51,121.92 | C1.- IC7.7 | C2.- 25.4,58.42 E7.7 | v22.23,10.79 8.26,10.79 U$1.AC2 | IC10.7 53.34,43.18 33.02,43.18 E4.7
IO2  (via drill 0.81)
  Top 0.406: v21.59,90.17 19.05,92.71 19.05,95.89 15.88,99.06 8.26,99.06 U$1.BK1
  Bottom 0.406: IC2.9 31.75,90.17 v21.59,90.17
IO3  (via drill 0.81)
  Top 0.406: v17.78,66.67 17.78,76.2 18.42,76.83 v18.42,91.44 | v22.86,91.44 20.32,93.98 20.32,100.33 15.24,105.41 8.26,105.41 U$1.BM1
  Bottom 0.406: IC5.9 86.36,88.9 89.54,88.9 95.25,83.19 95.25,67.31 24.13,67.31 23.5,66.67 v17.78,66.67 | v22.86,91.44 v18.42,91.44
IO_ENABL  (via drill 0.81)
  Top 0.406: IC2.8 29.21,90.17 v29.21,69.85 | v81.28,68.58 82.55,69.85 82.55,90.17 | IC5.8 82.55,90.17 | v81.28,100.97 82.55,99.69 82.55,90.17
  Bottom 0.406: v29.21,69.85 30.48,68.58 v81.28,68.58 | v81.28,100.97 74.93,100.97 73.03,102.87 56.52,102.87 55.25,104.14 30.48,104.14 29.21,102.87 8.26,102.87 U$1.BL2
MA2_H  (via drill 0.81)
  Top 0.406: v43.18,128.91 IC3.2 | v74.93,128.91 76.2,127.64 v76.2,38.1
  Bottom 0.406: E4.5 36.83,41.91 38.74,41.91 39.37,41.27 39.37,39.37 | 39.37,39.37 39.37,38.1 26.04,38.1 24.77,36.83 15.24,36.83 14.61,36.2 8.26,36.2 U$1.AM2 | v74.93,128.91 v43.18,128.91 | v76.2,38.1 61.6,38.1 59.69,40.01 59.69,41.91 57.79,41.91 57.15,41.27 57.15,39.37 39.37,39.37
MA2_L  (via drill 0.81)
  Top 0.406: E4.6 30.48,38.1 v30.48,36.83 | v15.88,35.56 8.26,35.56 U$1.AM1
  Bottom 0.406: v30.48,36.83 29.21,35.56 v15.88,35.56
MA3_H  (via drill 0.81)
  Top 0.406: IC6.2 97.79,123.19 97.79,125.09 98.43,125.73 100.33,125.73 v100.33,42.55
  Bottom 0.406: U$1.AL2 8.26,32.38 14.61,32.38 15.24,31.75 31.75,31.75 E4.9 34.29,34.29 92.08,34.29 v100.33,42.55
MA3_L  (via drill 0.81)
  Top 0.406: v16.51,33.02 8.26,33.02 U$1.AL1
  Bottom 0.406: v16.51,33.02 E4.8
MA_ENABL
  Top 0.406: IC3.3 40.64,125.73 36.2,130.18 23.5,130.18 23.5,125.73 19.05,121.28 19.05,114.94 16.51,112.39 8.26,112.39 U$1.BP1
MB2_H
  Top 0.406: E11.1 E11.2 | E8.5 59.69,59.69 59.69,80.01 E11.5 E11.4
  Bottom 0.406: E11.2 67.31,82.55 64.77,82.55 E11.4
MB2_L  (via drill 0.81)
  Top 0.406: E11.13 E11.12 | IC7.2 44.45,21.59 v44.45,35.56 | v55.88,36.83 57.15,38.1 57.15,57.15 E8.6 E11.9
  Bottom 0.406: E11.9 E11.10 62.23,74.93 64.77,74.93 E11.12 | v44.45,35.56 45.72,36.83 v55.88,36.83
MB3_H  (via drill 0.81)
  Top 0.406: E7.4 E7.5 | v58.42,53.98 E8.9
  Bottom 0.406: v58.42,53.98 53.98,58.42 E7.1 E7.2 41.91,59.69 39.37,59.69 E7.4
MB3_L  (via drill 0.81)
  Top 0.406: E7.13 E7.12 | IC9.2 67.31,21.59 v67.31,52.07
  Bottom 0.406: E7.9 E7.10 36.83,52.07 44.45,52.07 | 54.61,52.07 E8.8 | 44.45,52.07 54.61,52.07 | E7.13 44.45,52.07 | 54.61,52.07 v67.31,52.07
MEM2  (via drill 0.81)
  Top 0.406: R1.1 IC2.11 36.83,92.71 36.83,114.94 39.37,117.47 39.37,125.73 36.2,128.91 24.77,128.91 24.77,121.28 v22.86,119.38 | v16.51,119.38 16.51,116.2 15.88,115.57 8.26,115.57 U$1.BR1
  Bottom 0.406: v16.51,119.38 v22.86,119.38
MEM_ENABL  (via drill 0.81)
  Top 0.406: IC2.12 39.37,92.71 39.37,116.2 41.91,118.75 v41.91,124.46
  Bottom 0.406: v41.91,124.46 8.26,124.46 U$1.BU2
MQ2_H  (via drill 0.81)
  Top 0.406: IC1.2 67.31,97.79 64.77,97.79 64.77,99.69 64.14,100.33 54.61,100.33 v54.61,97.79 | v45.72,95.25 v48.26,97.79 | v17.78,95.25 17.78,93.34 17.15,92.71 8.26,92.71 U$1.BH1
  Bottom 0.406: v48.26,97.79 v54.61,97.79 | v17.78,95.25 v45.72,95.25
MQ3_H
  Bottom 0.406: IC3.11 35.56,109.22 8.26,109.22 U$1.BN2
MQ_ENABL  (via drill 0.81)
  Top 0.406: IC1.3 66.04,100.97 v60.33,106.68 | v16.51,91.44 16.51,90.17 8.26,90.17 U$1.BF1 | v26.67,92.71 26.67,100.33 27.94,101.6 v27.94,107.95
  Bottom 0.406: v60.33,106.68 56.52,110.49 41.91,110.49 IC3.12 36.83,107.95 v27.94,107.95 | v16.51,91.44 17.78,92.71 v26.67,92.71
N$5
  Top 0.406: R8.1 IC11.8 48.26,115.57 48.26,101.6 IC2.1 | IC1.1 71.12,93.98 IC1.13 62.23,97.79 | 62.23,97.79 60.96,96.52 IC1.10 | 62.23,97.79 IC1.4
  Bottom 0.406: IC2.4 39.37,100.33 44.45,100.33 IC2.1 46.99,100.33 62.23,100.33 IC1.4 | IC2.10 36.83,90.17 59.69,90.17 IC1.10
N$8  (via drill 0.81)
  Top 0.406: R10.1 IC5.4 | IC4.10 88.9,76.2 88.9,78.74 | 88.9,78.74 IC4.4 86.36,83.82 IC5.10 | 88.9,78.74 91.44,76.2 | 91.44,76.2 IC4.13 | 91.44,76.2 IC4.1 97.79,82.55 97.79,97.79 IC5.1 | IC11.10 57.15,111.76 v57.15,104.14
  Bottom 0.406: IC3.13 45.72,114.3 54.61,114.3 IC11.10 | IC5.1 91.44,104.14 R10.1 v57.15,104.14
N$12  (via drill 0.81)
  Top 0.406: IC3.10 35.56,114.94 38.1,117.47 IC3.4 | IC11.7 v53.34,118.11 50.8,115.57 v50.8,91.44 50.8,90.17 v52.07,88.9 | R9.1 59.69,87.63 v59.69,88.9
  Bottom 0.406: IC3.4 39.37,118.11 44.45,118.11 IC3.1 46.99,118.11 v53.34,118.11 | IC2.13 44.45,92.71 47.63,92.71 48.9,91.44 v50.8,91.44 | v52.07,88.9 v59.69,88.9
N$14
  Top 0.406: IC5.13 95.25,92.71 95.25,118.11 IC6.1 | IC11.11 R11.1 | IC6.10 88.9,114.3 IC6.4
  Bottom 0.406: IC11.11 60.96,110.49 85.09,110.49 IC6.10 | IC6.1 95.25,118.11 90.17,118.11 IC6.4
NO_SHIFT  (via drill 0.81)
  Top 0.406: v15.88,13.97 15.24,14.61 15.24,15.88 14.61,16.51 8.26,16.51 U$1.AE1
  Bottom 0.406: IC9.8 54.61,13.97 34.29,13.97 IC7.9 31.75,13.97 v15.88,13.97
PC2_H  (via drill 0.81)
  Top 0.406: v35.56,127.64 IC3.5 | v77.47,59.69 v77.47,127.64 | v17.15,41.27 17.15,41.91 8.26,41.91 U$1.AP1 | v58.42,44.45 59.69,45.72 v59.69,55.24
  Bottom 0.406: v77.47,127.64 v35.56,127.64 | E9.5 85.09,59.69 v77.47,59.69 74.93,57.15 61.6,57.15 v59.69,55.24 | v17.15,41.27 20.96,41.27 24.13,44.45 v58.42,44.45
PC2_L  (via drill 0.81)
  Top 0.406: E9.6 81.28,60.96 v81.28,62.23 | v27.94,62.87 26.04,60.96 26.04,49.53 v20.96,44.45
  Bottom 0.406: v81.28,62.23 80.65,62.87 v27.94,62.87 | v20.96,44.45 15.24,44.45 14.61,45.09 8.26,45.09 U$1.AR2
PC3_H  (via drill 0.81)
  Top 0.406: 80.01,54.61 78.74,55.88 78.74,118.75 83.19,123.19 86.36,123.19 IC6.5 | 80.01,54.61 v80.65,53.98 | v17.15,38.1 17.15,38.73 8.26,38.73 U$1.AN1 | v24.13,38.1 27.94,34.29 27.94,10.79 v33.66,5.08 | v65.41,5.08 80.01,19.68 80.01,54.61
  Bottom 0.406: v80.65,53.98 E9.9 | v24.13,38.1 v17.15,38.1 | v65.41,5.08 v33.66,5.08
PC3_L  (via drill 0.81)
  Top 0.406: v26.67,64.14 24.77,62.23 24.77,50.16 19.69,45.09 v19.69,43.18
  Bottom 0.406: E9.8 79.38,52.7 79.38,57.15 94.62,57.15 95.25,57.78 95.25,64.14 v26.67,64.14 | v19.69,43.18 19.05,42.55 8.26,42.55 U$1.AP2
PC_ENABL
  Bottom 0.406: U$1.BS2 8.26,118.11 31.75,118.11 IC3.6 34.29,120.65 46.36,120.65 47.63,119.38 71.76,119.38 73.03,120.65 82.55,120.65 IC6.6
SC2  (via drill 0.81)
  Top 0.406: IC2.5 35.56,93.34 34.29,92.08 v34.29,86.36 | v17.15,87.63 15.24,85.72 15.24,84.45 14.61,83.82 8.26,83.82 U$1.BD1
  Bottom 0.406: v34.29,86.36 24.77,86.36 23.5,87.63 v17.15,87.63
SC3  (via drill 0.81)
  Top 0.406: v74.93,125.73 v74.93,102.87 | v32.39,123.19 22.86,113.67 22.86,112.39 19.69,109.22 8.26,109.22 U$1.BN1
  Bottom 0.406: IC5.5 82.55,102.87 v74.93,102.87 | v74.93,125.73 52.71,125.73 50.17,123.19 v32.39,123.19
SC_ENABL  (via drill 0.81)
  Top 0.406: IC5.6 v83.82,96.52 | v19.69,90.17 20.96,88.9 20.96,83.19 21.59,82.55 21.59,69.85 20.96,69.22 20.96,67.94 23.5,65.41 29.21,65.41 v29.21,60.33 | v48.26,61.59 49.53,62.87 v49.53,101.6
  Bottom 0.406: IC2.6 34.29,97.79 36.2,97.79 36.83,98.42 36.83,101.6 v49.53,101.6 70.49,101.6 75.57,96.52 v83.82,96.52 | v19.69,90.17 8.26,90.17 U$1.BF2 | v29.21,60.33 38.74,60.33 40.01,61.59 v48.26,61.59
SHIFT_L1
  Bottom 0.406: IC9.12 67.31,11.43 69.22,11.43 69.85,12.06 69.85,16.51 94.62,16.51 97.79,19.68 97.79,21.59 95.25,21.59 IC8.2 91.44,22.86 22.86,22.86 20.32,20.32 8.26,20.32 U$1.AF2
SHIFT_L2  (via drill 0.81)
  Top 0.406: v82.55,35.56 83.82,34.29 IC8.6 | v17.15,26.04 17.15,23.5 8.26,23.5 U$1.AH1 | v30.48,26.04 34.29,29.84 v34.29,35.56
  Bottom 0.406: 58.42,38.1 58.42,35.56 v82.55,35.56 | 58.42,38.1 IC10.6 | v30.48,26.04 v17.15,26.04 | v34.29,35.56 35.56,36.83 44.45,36.83 45.72,38.1 58.42,38.1
SHIFT_R1  (via drill 0.81)
  Top 0.406: 36.2,10.79 34.93,9.53 34.93,4.45 34.29,3.81 24.77,3.81 v24.77,10.16 | 36.2,10.79 IC7.11 | IC10.2 69.85,39.37 69.85,15.88 67.31,13.34 v67.31,10.16 | 36.2,10.79 v38.1,8.89
  Bottom 0.406: v24.77,10.16 22.23,12.7 15.24,12.7 14.61,13.34 8.26,13.34 U$1.AD2 | v67.31,10.16 66.04,8.89 v38.1,8.89
SHIFT_R2  (via drill 0.81)
  Top 0.406: v18.42,17.78 17.15,16.51 17.15,13.34 16.51,12.7 15.24,12.7 14.61,13.34 8.26,13.34 U$1.AD1
  Bottom 0.406: IC9.5 57.15,16.51 39.37,16.51 IC7.5 33.02,17.78 v18.42,17.78
SR2  (via drill 0.81)
  Top 0.406: IC2.2 41.91,97.79 v41.91,88.9 | v15.88,88.9 15.24,88.27 15.24,87.63 14.61,87 8.26,87 U$1.BE1
  Bottom 0.406: v15.88,88.9 v41.91,88.9
SR3  (via drill 0.81)
  Top 0.406: v20.32,71.12 20.32,82.55 v19.69,83.19
  Bottom 0.406: IC5.2 87.63,92.71 83.19,92.71 82.55,92.08 82.55,87.63 89.54,87.63 92.71,84.45 92.71,69.85 31.12,69.85 29.85,71.12 v20.32,71.12 | v19.69,83.19 8.26,83.19 U$1.BD2
SR_ENABL  (via drill 0.81)
  Top 0.406: IC2.3 44.45,102.87 44.45,121.28 52.07,128.91 72.39,128.91 v72.39,101.6 73.66,100.33 v73.66,83.82 | v17.15,81.92 17.15,80.64 8.26,80.64 U$1.BC1
  Bottom 0.406: v72.39,101.6 76.2,97.79 90.17,97.79 IC5.3 | v17.15,81.92 23.5,81.92 24.13,82.55 31.12,82.55 32.39,83.82 v73.66,83.82
TT_SHIFT
  Top 0.406: R4.1 58.42,30.48 IC10.9
  Bottom 0.406: IC8.9 85.09,11.43 92.71,11.43 | IC8.13 92.71,11.43 | R4.1 62.23,26.67 93.98,26.67 99.06,21.59 99.06,11.43 92.71,11.43
VCC  (via drill 0.81)
  Top 0.406: IC8.14 R3.2 C8.+ | IC9.14 72.39,13.97 72.39,24.13 R13.2 R4.2 IC10.14 72.39,34.29 72.39,49.53 E8.14 | E8.10 63.5,53.34 E8.4 | E8.14 E8.13 | E8.14 E8.1 E11.14 72.39,74.93 72.39,85.09 R9.2 IC1.14 72.39,92.71 72.39,99.69 68.58,103.5 R11.2 | IC6.14 96.52,106.68 R10.2 R2.2 | E9.10 88.9,53.34 E9.4 | E9.14 E9.1 IC4.14 99.06,76.2 R5.2 | E4.4 35.56,38.1 E4.10 | IC7.14 46.99,13.97 46.99,31.75 E4.14 E4.1 E7.14 46.99,52.07 46.99,72.39 E10.14 E10.1 48.26,83.82 R1.2 48.26,88.9 46.99,90.17 | C1.+ 20.96,6.99 20.96,24.77 22.86,26.67 C2.+ | C4.+ 22.86,93.34 24.13,92.08 24.13,85.09 24.77,84.45 24.77,70.48 C3.+ | E10.10 38.1,76.2 E10.4 46.99,90.17 | 62.23,121.92 63.5,123.19 R8.2 | 62.23,121.92 IC11.5 | 46.99,90.17 IC2.14 44.45,92.71 44.45,99.69 45.72,100.97 v45.72,106.68 IC3.14 46.99,113.03 46.99,120.02 52.71,125.73 58.42,125.73 62.23,121.92
  Bottom 0.406: IC8.14 95.25,13.97 90.17,13.97 IC8.11 87.63,13.97 72.39,13.97 IC9.14 | R12.2 57.15,24.13 69.85,24.13 R13.2 | E8.10 62.23,49.53 67.31,49.53 E8.13 | C5.+ 101.6,104.14 R10.2 99.06,91.44 IC5.14 96.52,86.36 R5.2 104.14,86.36 C6.+ | E9.14 E9.13 92.71,52.07 87.63,52.07 E9.10 85.09,49.53 72.39,49.53 E8.14 | C7.+ 104.14,58.42 E9.1 | C1.+ 16.51,5.08 15.88,4.45 8.26,4.45 U$1.AA2 | E4.10 36.83,31.75 41.91,31.75 E4.13 E4.14 | C2.+ 24.13,39.37 36.83,39.37 E4.4 | C3.+ 21.59,69.85 19.69,69.85 15.88,73.66 8.26,73.66 U$1.BA2 | E10.14 E10.13 | R11.2 66.04,109.22 59.06,109.22 56.52,111.76 IC3.14 | v45.72,106.68 C4.+